# EAGLE design RN-42 (EAGLE 6.2)
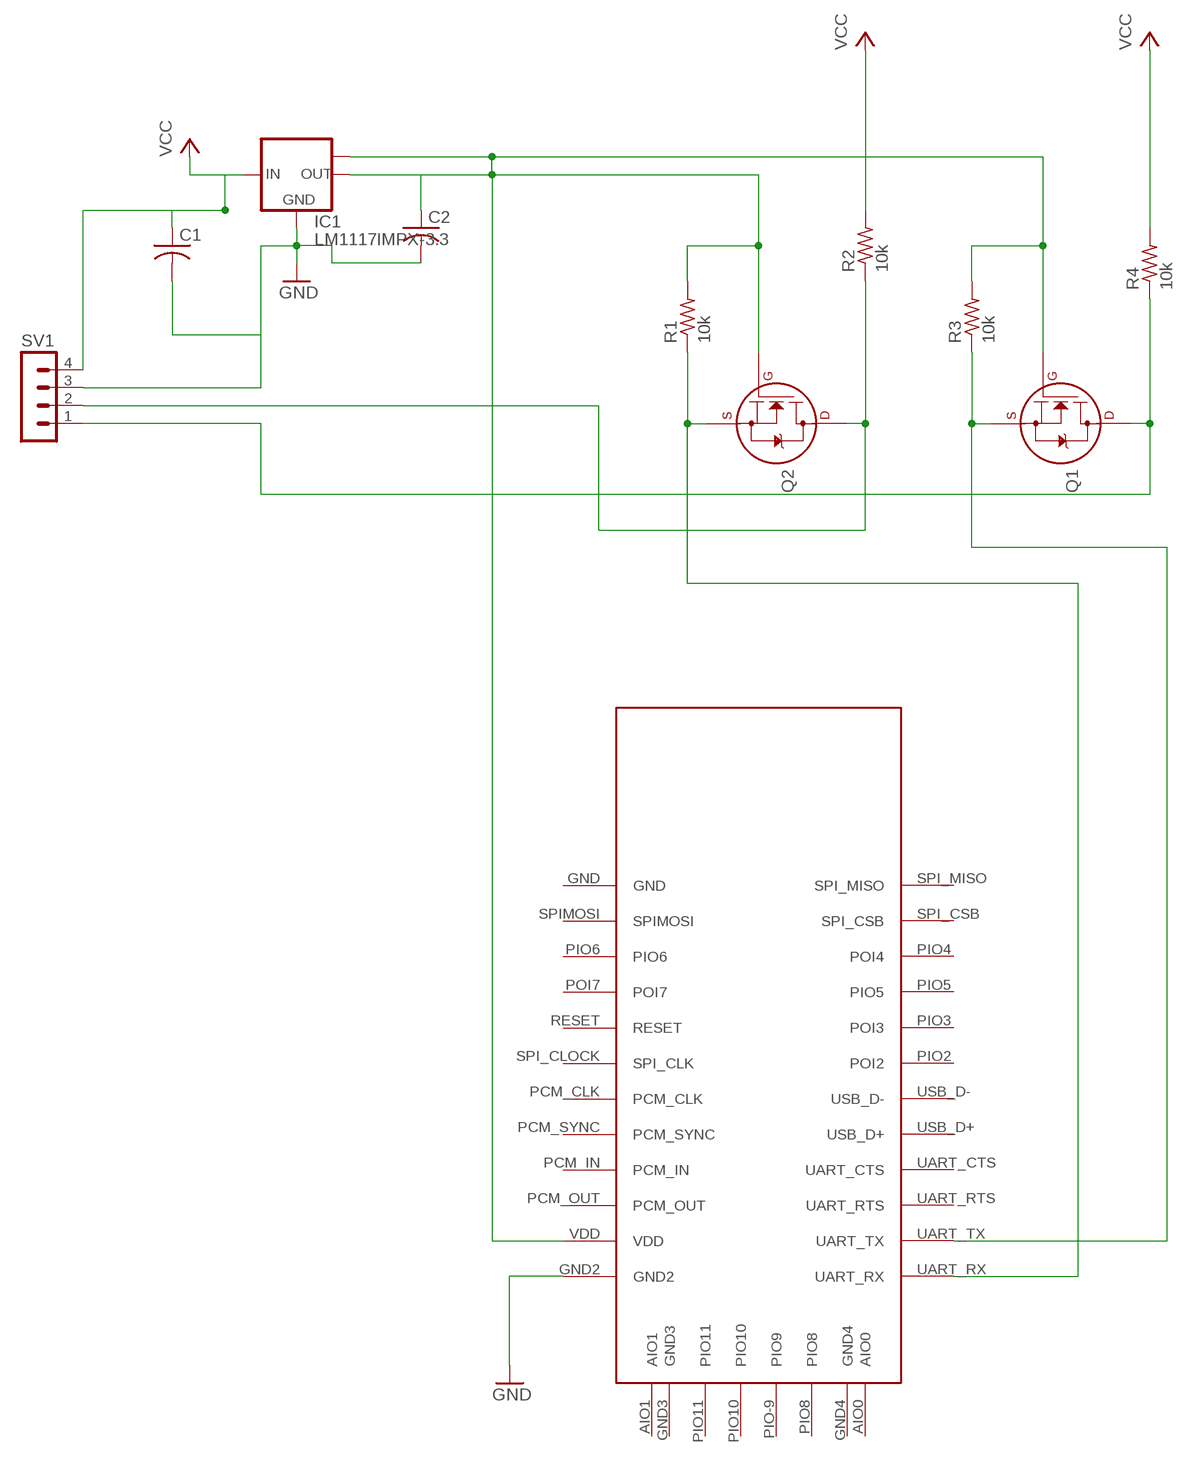
[diagram p0: schematic, sheet 1]

## Parts
C1  C-USC0805  [C0805]
C2  C-USC0805  [C0805]
IC1  LM1117IMPX-3.3  [SOT223]
Q1  2N7002_SOT23  [SOT-23]
Q2  2N7002_SOT23  [SOT-23]
R1  10k  R-US_M0805  [M0805]
R2  10k  R-US_M0805  [M0805]
R3  10k  R-US_M0805  [M0805]
R4  10k  R-US_M0805  [M0805]
SV1  MA04-1  [MA04-1]
U$1  RN-42  [RN-42]

## Nets
GND: C1.2 C2.2 IC1.1(GND) SV1.3 U$1.GND2
N$1: Q2.2(S) R1.1 U$1.UART_RX
N$2: Q2.3(D) R2.1 SV1.2
N$3: Q1.2(S) R3.1 U$1.UART_TX
N$4: Q1.3(D) R4.1 SV1.1
N$5: C2.1 IC1.2(OUT) IC1.TAB(OUT1) Q1.1(G) Q2.1(G) R1.2 R3.2 U$1.VDD
VCC: C1.1 IC1.3(IN) R2.2 R4.2 SV1.4
Unconnected: U$1.AIO0 U$1.AIO1 U$1.GND U$1.GND3 U$1.GND4 U$1.PCM_CLK U$1.PCM_IN U$1.PCM_OUT U$1.PCM_SYNC U$1.PIO2(POI2) U$1.PIO3(POI3) U$1.PIO4(POI4) U$1.PIO5 U$1.PIO6 U$1.PIO8 U$1.PIO10 U$1.PIO11 U$1.PIO-9(PIO9) U$1.POI7 U$1.RESET U$1.SPI_CLOCK(SPI_CLK) U$1.SPI_CSB U$1.SPI_MISO U$1.SPIMOSI U$1.UART_CTS U$1.UART_RTS U$1.USB_D+ U$1.USB_D-

## Library data of the parts
C1 C2 = rcl:C-US: CAPACITOR, American symbol
IC1 = lm1117 (1):LM1117IMPX-*
Q1 Q2 = transistors:2N700*: 2N7000, 2N7002, NDS7002A N-channel enhancement mode MOSFET
R1-R4 = rcl:R-US_: RESISTOR, American symbol
SV1 = con-lstb:MA04-1: PIN HEADER; OC_FARNELL: unknown; OC_NEWARK: unknown
U$1 = RN-42:RN-42

## Board
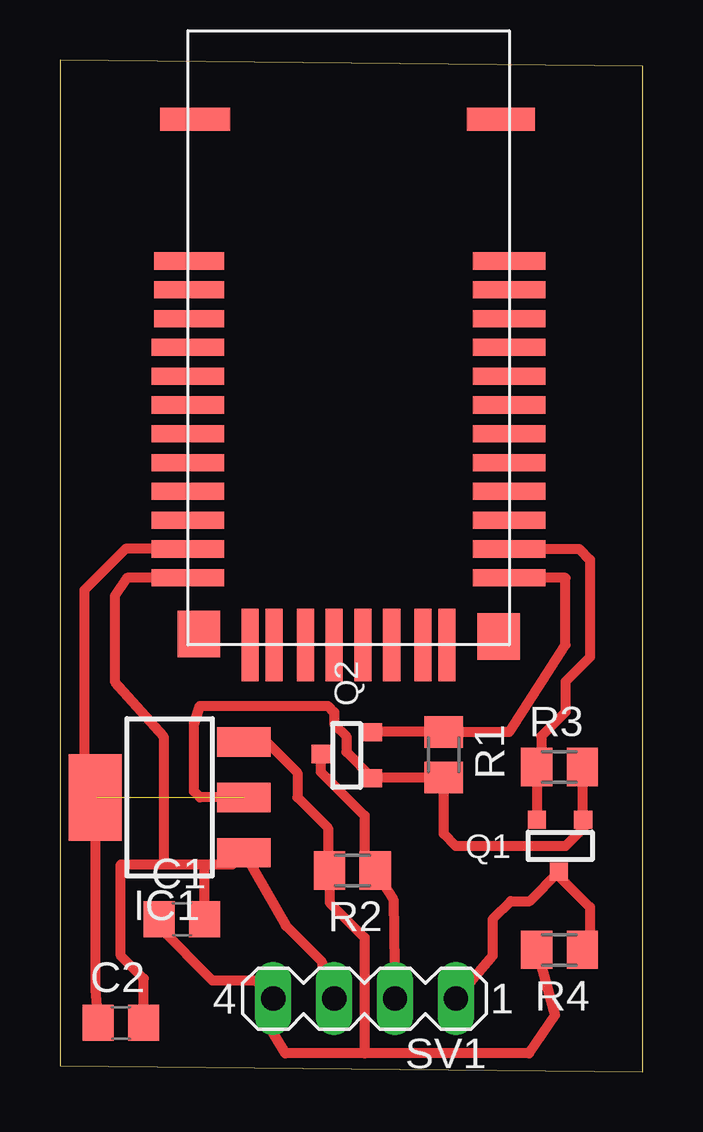
[diagram p1: board, top side]

Size 24.31 x 42.15 mm. Coordinates in mm from the lower left corner, seen from the top.
Outline: 0,0.25 24.31,0 24.31,41.9 0,42.15 0,0.25
Copper layers (1*16): Top 0.035mm / dielectric 1.5mm / Bottom 0.035mm
Design rules: minimum track width 10mil, minimum drill 24mil, track to track 8mil, track to pad 8mil, pad to pad 8mil, via to via 8mil, smd to smd 8mil, copper to edge 40mil, drill to drill 8mil, minimum pad ring 10mil, minimum via ring 8mil, stop-mask expansion 4mil, vias tented up to drill 0mil, thermal gap 10mil

### Footprints (pad centres in the part's own frame; a part is rotated, then mirrored left to right if it is on the bottom)
C0805 = smd 1.3 x 1.5: 1 -0.95,0; 2 0.95,0
SOT223 = smd 1.219 x 2.235: 1 -2.311,-3.099; 2 0,-3.099; 3 2.311,-3.099 | smd 3.6 x 2.2: TAB 0,3.099
SOT-23 = smd 0.762 x 0.762: 1 -0.979,-1.101; 2 0.94,-1.101; 3 0.025,1.067
M0805 = smd 1.3 x 1.6: 1 -0.95,0; 2 0.95,0
MA04-1 = drill 1.016 long: 1 -3.81,0; 2 -1.27,0; 3 1.27,0; 4 3.81,0
RN-42 = smd 0.711 x 1.422: AIO0 10.8,0.8; AIO1 2.6,0.8; GND3 3.6,0.8; GND4 9.8,0.8; P$92 2.6,0; P$93 2.6,0.3; P$94 2.6,0.7; P$96 2.6,-0.8; P$98 3.6,0; P$99 3.6,-0.8; P$101 4.9,0.5; P$102 4.9,-0.8; P$103 6.1,-0.8; P$104 6.1,0.2; P$108 7.3,0.1; P$109 7.3,-0.7; P$110 7.3,-0.8; P$111 8.5,0.8; P$113 8.5,0.1; P$114 8.5,-0.8; P$116 9.8,0.3; P$117 9.8,-0.8; P$119 10.8,0.6; P$120 10.8,-0.8; PIO8 8.5,0.6; PIO10 6.1,0.8; PIO11 4.9,0.8; PIO-9 7.3,0.8 | smd 1.422 x 0.711: GND 0.8,16; GND2 0.8,2.8; P$3 0,2.8; P$4 0,4; P$5 0,5.2; P$6 0,6.4; P$7 0,7.6; P$8 0,8.8; P$15 -0.6,8.8; P$16 -0.5,7.6; P$17 -0.5,6.4; P$18 -0.6,7.6; P$19 -0.6,6.4; P$20 -0.7,5.2; P$21 -0.7,6.4; P$22 -0.7,7.6; P$23 -0.7,8.8; P$24 -0.7,4; P$25 -0.7,2.8; P$26 -0.7,10; P$27 0.6,10; P$29 0,11.2; P$30 -0.7,11.2; P$32 -0.1,12.4; P$33 -0.7,12.4; P$35 0.3,13.6; P$37 -0.7,13.6; P$38 0.1,14.8; P$40 -0.7,14.8; P$41 0,16; P$42 -0.7,16; P$44 13.5,2.8; P$45 13.1,2.8; P$47 14.2,2.8; P$48 -0.8,2.8; P$49 -0.8,4; P$50 -0.8,5.2; P$51 -0.8,6.4; P$52 -0.8,7.6; P$53 -0.8,8.8; P$54 -0.8,10; P$55 -0.8,11.2; P$56 -0.8,12.4; P$58 14,4; P$59 14.2,4; P$61 14,5.2; P$62 14.2,5.2; P$65 13.8,6.4; P$66 14.2,6.4; P$67 13.3,7.6; P$69 14.2,7.6; P$71 13.3,8.8; P$72 14.2,8.8; P$73 13.3,10; P$75 14.2,10; P$76 13.4,11.2; P$78 14.2,11.2; P$79 13.5,12.4; P$81 14.2,12.4; P$82 13.3,13.6; P$84 14.2,13.6; P$85 14.1,14.8; P$86 14.2,14.8; P$87 13.8,14.8; P$89 13.5,16; P$91 14.2,16; PCM_CLK 0.8,8.8; PCM_IN 0.8,6.4; PCM_OUT 0.8,5.2; PCM_SYNC 0.8,7.6; PIO2 12.6,10; PIO3 12.6,11.2; PIO4 12.6,13.6; PIO5 12.6,12.4; PIO6 0.8,13.6; POI7 0.8,12.4; RESET 0.8,11.2; SPI_CLOCK 0.8,10; SPI_CSB 12.6,14.8; SPI_MISO 12.6,16; SPIMOSI 0.8,14.8; UART_CTS 12.6,6.4; UART_RTS 12.6,5.2; UART_RX 12.6,2.8; UART_TX 12.6,4; USB_D+ 12.6,7.6; USB_D- 12.6,8.8; VDD 0.8,4 | smd 1.676 x 0.813: P$2 0.9,21.9 | smd 1.27 x 0.635: P$121 0.7,0.4; P$122 0.7,0.8; P$123 0.7,0.3; P$124 12.7,0.3; P$125 12.7,0.7; P$126 12.7,1; P$127 0.7,1.1; P$128 13.2,1; P$129 13.2,0.4; P$130 13.2,0.2; P$131 13.2,-0.1; P$132 12.7,-0.1; P$133 0.7,-0.2; P$134 0.2,-0.2; P$135 0.2,0.2; P$136 0.2,0.6; P$137 0.2,1.1; P$138 12.7,-0.3; P$139 13.2,-0.3 | smd 1.93 x 0.965: P$140 0.8,21.9; P$141 -0.2,21.9; P$142 12.6,21.9; P$143 13.5,21.9

### Placement (x,y rotation side)
C1  5.08,6.35 0 top
C2  2.54,2.03 0 top
IC1  4.57,11.43 90 top
Q1  20.83,9.4 180 top
Q2  11.94,13.21 90 top
R1  16,13.21 270 top
R2  12.19,8.38 180 top
R3  20.83,12.7 0 top
R4  20.83,5.08 180 top
SV1  12.7,3.05 180 top
U$1  5.33,17.78 0 top

### Tracks (layer width: path | path; a pad name or v marks a point on that pad's centre or on a via)
GND
  Top 0.406: SV1.3 10.92,3.81 10.92,4.57 9.42,6.07 IC1.1 7.19,8.64 6.1,8.64 | U$1.GND2 2.8,20.58 2.29,19.81 2.29,16.26 4.32,13.97 4.32,8.64 | C2.2 3.49,3.88 2.54,4.83 2.54,8.64 4.32,8.64 | 4.32,8.64 6.1,8.64 | C1.2 6.03,8.57 6.1,8.64
N$1
  Top 0.406: U$1.UART_RX 18.96,20.57 21.08,20.57 21.08,17.78 18.73,14.16 R1.1 Q2.2
N$2
  Top 0.406: SV1.2 13.97,3.56 | 14.2,3.53 SV1.2 | SV1.2 13.72,3.05 | Q2.3 10.87,12.5 12.7,10.67 12.7,8.82 R2.1 13.9,7.18 SV1.2
N$3
  Top 0.406: U$1.UART_TX 21.65,21.78 22.1,21.34 22.1,17.27 21.08,16.26 21.08,14.99 20.07,13.97 20.07,12.89 R3.1 19.88,10.51 Q1.2
N$4
  Top 0.406: SV1.1 18.03,4.83 18.03,6.35 18.8,7.11 19.58,7.11 Q1.3 20.8,8.15 22.1,6.86 22.1,5.4 R4.1
N$5  (1 unrouted)
  Top 0.406: Q1.1 21.78,10.53 R3.2 21.78,10.48 21.84,10.41 21.84,10.16 21.08,9.4 16.51,9.4 16,9.91 R1.2 13.07,12.26 Q2.1 11.94,13.33 11.94,13.97 11.43,14.48 11.43,14.99 11.18,15.24 5.84,15.24 5.59,14.48 5.59,11.68 5.84,11.43 IC1.2 | IC1.TAB 1.47,3.42 C2.1 | IC1.TAB 1.52,11.43 | U$1.VDD 2.73,21.78 1.02,20.07 1.02,11.89 IC1.TAB
VCC
  Top 0.406: R4.2 20.64,2.35 19.56,0.76 12.7,0.76 | 12.7,0.76 9.4,0.76 8.64,2.03 8.64,3.05 SV1.4 8.13,3.81 6.35,3.81 4.13,6.03 C1.1 | 12.7,0.76 12.7,5.59 11.24,7.05 R2.2 11.18,8.45 11.18,10.16 9.91,11.43 9.91,12.45 8.61,13.74 IC1.3